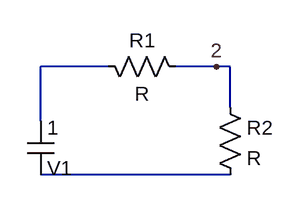
[diagram p0: schematic Draft1.asc]
Draft1.asc, the LTspice schematic file:
Version 4
SHEET 1 880 680
WIRE 160 -144 80 -144
WIRE 288 -144 240 -144
WIRE 304 -144 288 -144
WIRE 304 -96 304 -144
WIRE 80 -80 80 -144
WIRE 304 -16 80 -16
FLAG 288 -144 2
SYMBOL res 256 -128 M270
WINDOW 0 32 56 VTop 2
WINDOW 3 0 56 VBottom 2
SYMATTR InstName R1
SYMBOL res 288 -112 R0
SYMATTR InstName R2
SYMBOL cap 64 -80 R0
SYMATTR InstName 1
SYMATTR Value V1

The netlist it stands for:
* Draft1.asc
R1 2 N001 R
R2 2 N002 R
C§1 N001 N002 V1
.backanno
.end